# EAGLE schematic VDAC2 (EAGLE 8.3.1)
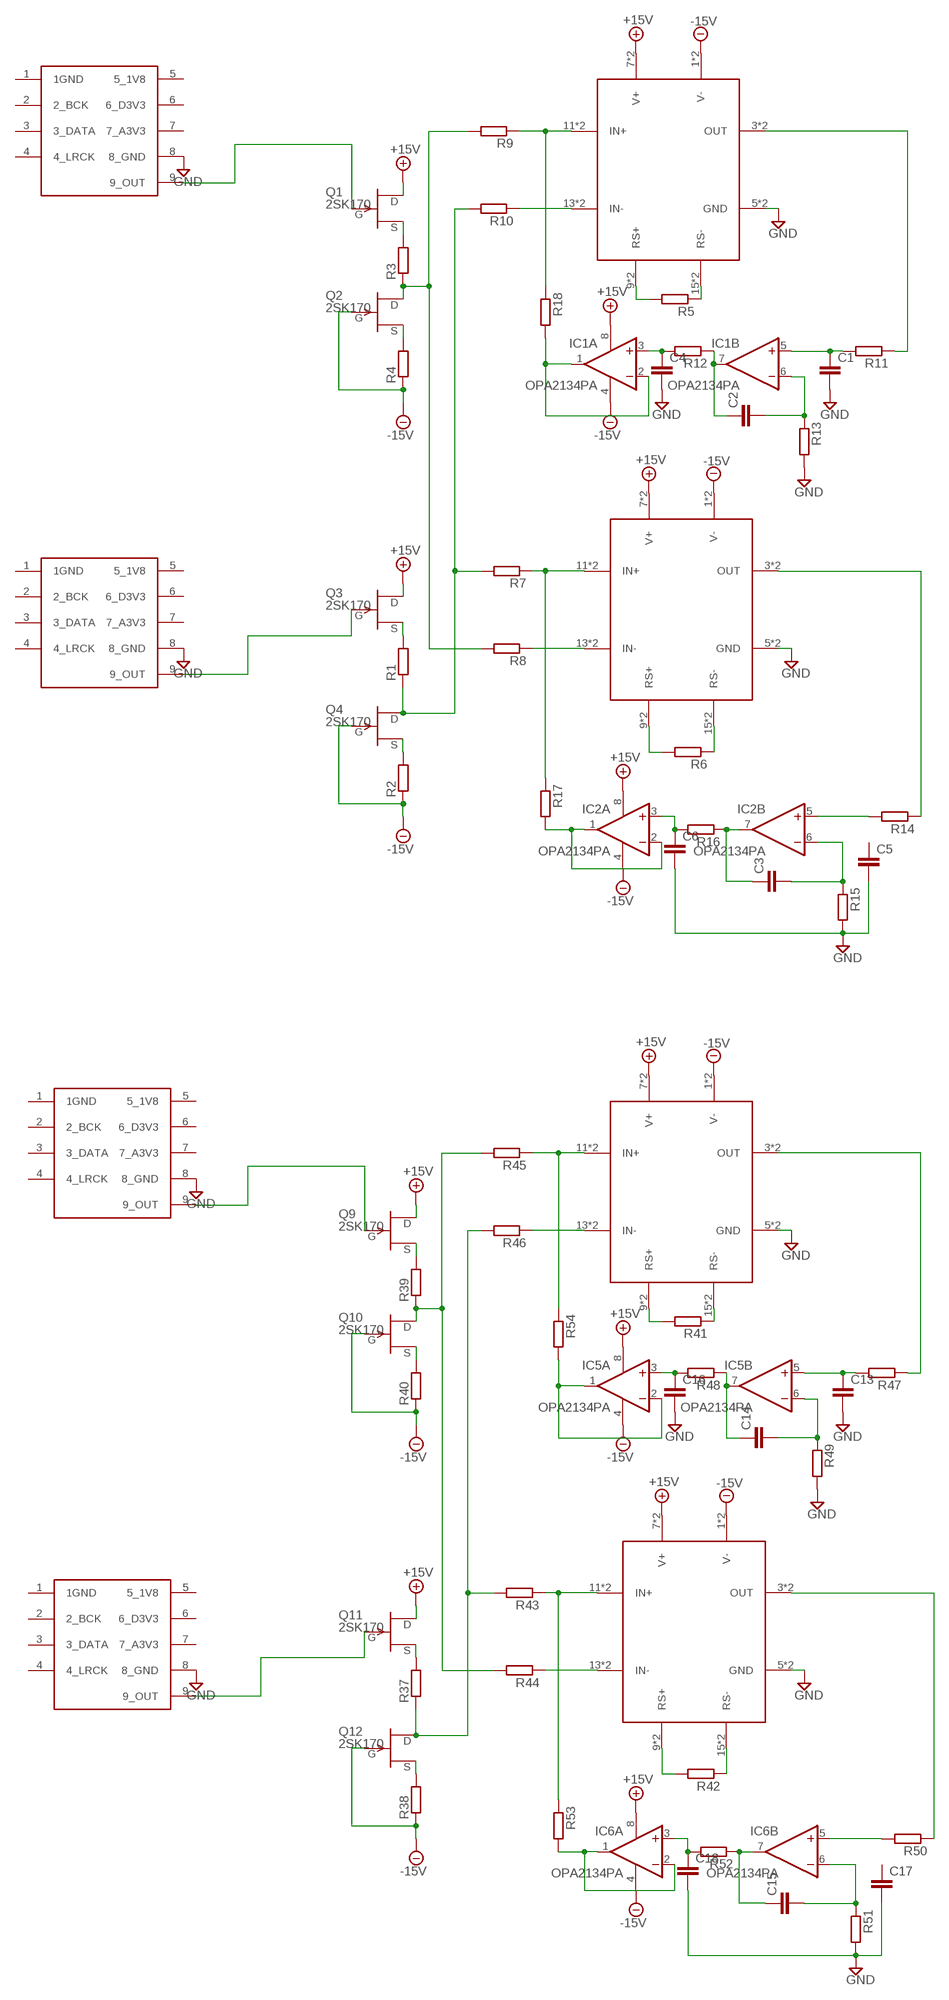
[diagram p0: schematic, sheet 1]

## Parts
C1  C-EU050-050X075  [C050-050X075]
C2  C-EU050-035X075  [C050-035X075]
C3  C-EU050-035X075  [C050-035X075]
C4  C-EU050-035X075  [C050-035X075]
C5  C-EU050-050X075  [C050-050X075]
C6  C-EU050-035X075  [C050-035X075]
C13  C-EU050-050X075  [C050-050X075]
C14  C-EU050-035X075  [C050-035X075]
C15  C-EU050-035X075  [C050-035X075]
C16  C-EU050-035X075  [C050-035X075]
C17  C-EU050-050X075  [C050-050X075]
C18  C-EU050-035X075  [C050-035X075]
IC1  OPA2134PA  [DIL08]
IC2  OPA2134PA  [DIL08]
IC5  OPA2134PA  [DIL08]
IC6  OPA2134PA  [DIL08]
Q1  2SK170  [TO92-]
Q2  2SK170  [TO92-]
Q3  2SK170  [TO92-]
Q4  2SK170  [TO92-]
Q9  2SK170  [TO92-]
Q10  2SK170  [TO92-]
Q11  2SK170  [TO92-]
Q12  2SK170  [TO92-]
R1  R-EU_0309/10  [0309/10]
R2  R-EU_0309/10  [0309/10]
R3  R-EU_0309/10  [0309/10]
R4  R-EU_0309/10  [0309/10]
R5  R-EU_0309/10  [0309/10]
R6  R-EU_0309/10  [0309/10]
R7  R-EU_0309/10  [0309/10]
R8  R-EU_0309/10  [0309/10]
R9  R-EU_0309/10  [0309/10]
R10  R-EU_0309/10  [0309/10]
R11  R-EU_0309/10  [0309/10]
R12  R-EU_0309/10  [0309/10]
R13  R-EU_0309/10  [0309/10]
R14  R-EU_0309/10  [0309/10]
R15  R-EU_0309/10  [0309/10]
R16  R-EU_0309/10  [0309/10]
R17  R-EU_0309/10  [0309/10]
R18  R-EU_0309/10  [0309/10]
R37  R-EU_0309/10  [0309/10]
R38  R-EU_0309/10  [0309/10]
R39  R-EU_0309/10  [0309/10]
R40  R-EU_0309/10  [0309/10]
R41  R-EU_0309/10  [0309/10]
R42  R-EU_0309/10  [0309/10]
R43  R-EU_0309/10  [0309/10]
R44  R-EU_0309/10  [0309/10]
R45  R-EU_0309/10  [0309/10]
R46  R-EU_0309/10  [0309/10]
R47  R-EU_0309/10  [0309/10]
R48  R-EU_0309/10  [0309/10]
R49  R-EU_0309/10  [0309/10]
R50  R-EU_0309/10  [0309/10]
R51  R-EU_0309/10  [0309/10]
R52  R-EU_0309/10  [0309/10]
R53  R-EU_0309/10  [0309/10]
R54  R-EU_0309/10  [0309/10]
U$1  7130MOD  [7130MOD]
U$2  7130MOD  [7130MOD]
U$5  R2R  [R2R]
U$6  R2R  [R2R]
U$9  R2R  [R2R]
U$10  R2R  [R2R]
U$11  7130MOD  [7130MOD]
U$12  7130MOD  [7130MOD]

## Nets
+15V: IC1.8(A:V+) IC2.8(A:V+) IC5.8(A:V+) IC6.8(A:V+) Q1.1(D) Q3.1(D) Q9.1(D) Q11.1(D) U$1.7(V+) U$1.8(V+) U$2.7(V+) U$2.8(V+) U$11.7(V+) U$11.8(V+) U$12.7(V+) U$12.8(V+)
-15V: IC1.4(A:V-) IC2.4(A:V-) IC5.4(A:V-) IC6.4(A:V-) Q2.2(G) Q4.2(G) Q10.2(G) Q12.2(G) R2.1 R4.1 R38.1 R40.1 U$1.1(V-) U$1.2(V-) U$2.1(V-) U$2.2(V-) U$11.1(V-) U$11.2(V-) U$12.1(V-) U$12.2(V-)
GND: C1.2 C4.2 C5.2 C6.2 C13.2 C16.2 C17.2 C18.2 R13.2 R15.2 R49.2 R51.2 U$1.5(GND) U$1.6(GND) U$2.5(GND) U$2.6(GND) U$5.8(8_GND) U$6.8(8_GND) U$9.8(8_GND) U$10.8(8_GND) U$11.5(GND) U$11.6(GND) U$12.5(GND) U$12.6(GND)
N$1: Q4.3(S) R2.2
N$2: R7.1 R17.1 U$1.11(IN+) U$1.12(IN+)
N$3: R9.1 R18.1 U$2.11(IN+) U$2.12(IN+)
N$4: Q3.3(S) R1.2
N$5: Q2.3(S) R4.2
N$6: R8.1 U$1.13(IN-) U$1.14(IN-)
N$7: Q2.1(D) R3.1 R8.2 R9.2
N$8: Q4.1(D) R1.1 R7.2 R10.2
N$9: R6.1 U$1.15(RS-) U$1.16(RS-)
N$10: R6.2 U$1.9(RS+) U$1.10(RS+)
N$11: R5.2 U$2.9(RS+) U$2.10(RS+)
N$12: R5.1 U$2.15(RS-) U$2.16(RS-)
N$13: Q1.3(S) R3.2
N$14: R10.1 U$2.13(IN-) U$2.14(IN-)
N$16: Q3.2(G) U$6.9(9_OUT)
N$17: Q1.2(G) U$5.9(9_OUT)
N$19: C1.1 IC1.5(B:+IN) R11.2
N$20: R11.1 U$2.3(OUT) U$2.4(OUT)
N$21: IC2.1(A:OUT) IC2.2(A:-IN) R17.2
N$22: IC1.1(A:OUT) IC1.2(A:-IN) R18.2
N$23: C3.1 IC2.7(B:OUT) R16.1
N$24: C3.2 IC2.6(B:-IN) R15.1
N$25: C2.2 IC1.6(B:-IN) R13.1
N$26: C2.1 IC1.7(B:OUT) R12.1
N$27: C4.1 IC1.3(A:+IN) R12.2
N$28: C6.1 IC2.3(A:+IN) R16.2
N$30: IC2.5(B:+IN) R14.2
N$32: R14.1 U$1.3(OUT) U$1.4(OUT)
N$57: Q12.3(S) R38.2
N$58: Q11.3(S) R37.2
N$59: Q10.3(S) R40.2
N$60: Q10.1(D) R39.1 R44.2 R45.2
N$61: R42.1 U$11.15(RS-) U$11.16(RS-)
N$62: R42.2 U$11.9(RS+) U$11.10(RS+)
N$63: R41.2 U$12.9(RS+) U$12.10(RS+)
N$64: R41.1 U$12.15(RS-) U$12.16(RS-)
N$65: Q9.3(S) R39.2
N$66: Q12.1(D) R37.1 R43.2 R46.2
N$67: Q11.2(G) U$10.9(9_OUT)
N$68: Q9.2(G) U$9.9(9_OUT)
N$69: R43.1 R53.1 U$11.11(IN+) U$11.12(IN+)
N$70: R44.1 U$11.13(IN-) U$11.14(IN-)
N$71: R45.1 R54.1 U$12.11(IN+) U$12.12(IN+)
N$72: R46.1 U$12.13(IN-) U$12.14(IN-)
N$73: C13.1 IC5.5(B:+IN) R47.2
N$74: R47.1 U$12.3(OUT) U$12.4(OUT)
N$75: IC6.1(A:OUT) IC6.2(A:-IN) R53.2
N$76: IC5.1(A:OUT) IC5.2(A:-IN) R54.2
N$77: C15.1 IC6.7(B:OUT) R52.1
N$78: C15.2 IC6.6(B:-IN) R51.1
N$79: C14.1 IC5.7(B:OUT) R48.1
N$80: C16.1 IC5.3(A:+IN) R48.2
N$81: C14.2 IC5.6(B:-IN) R49.1
N$82: C18.1 IC6.3(A:+IN) R52.2
N$83: IC6.5(B:+IN) R50.2
N$84: R50.1 U$11.3(OUT) U$11.4(OUT)
Unconnected: C5.1 C17.1 U$5.1(1GND) U$5.2(2_BCK) U$5.3(3_DATA) U$5.4(4_LRCK) U$5.5(5_1V8) U$5.6(6_D3V3) U$5.7(7_A3V3) U$6.1(1GND) U$6.2(2_BCK) U$6.3(3_DATA) U$6.4(4_LRCK) U$6.5(5_1V8) U$6.6(6_D3V3) U$6.7(7_A3V3) U$9.1(1GND) U$9.2(2_BCK) U$9.3(3_DATA) U$9.4(4_LRCK) U$9.5(5_1V8) U$9.6(6_D3V3) U$9.7(7_A3V3) U$10.1(1GND) U$10.2(2_BCK) U$10.3(3_DATA) U$10.4(4_LRCK) U$10.5(5_1V8) U$10.6(6_D3V3) U$10.7(7_A3V3)

## Library data of the parts
C1-C6 C13-C18 = Vwvwbg:C-EU: CAPACITOR, European symbol
IC1 IC2 IC5 IC6 = linear:OPA2*: Dual Operational Amplifier Low Power, Single-Supply, Rail-To-Rail Operational Amplifier Source: http://focus.ti.com/lit/ds/symlink/opa2345.pdf http://focus.ti.com .. opa241.pdf http://focus.ti.com/lit/ds/symlink/opa2134.pdf
Q1-Q4 Q9-Q12 = tranzistory FET:2SK170: N-Channel Junction FET
R1-R18 R37-R54 = Vwvwbg:R-EU_: RESISTOR, European symbol
U$1 U$2 U$11 U$12 = Vwvwbg:7130MOD
U$5 U$6 U$9 U$10 = Vwvwbg:R2R